# EAGLE design Rev B (EAGLE 6.4)
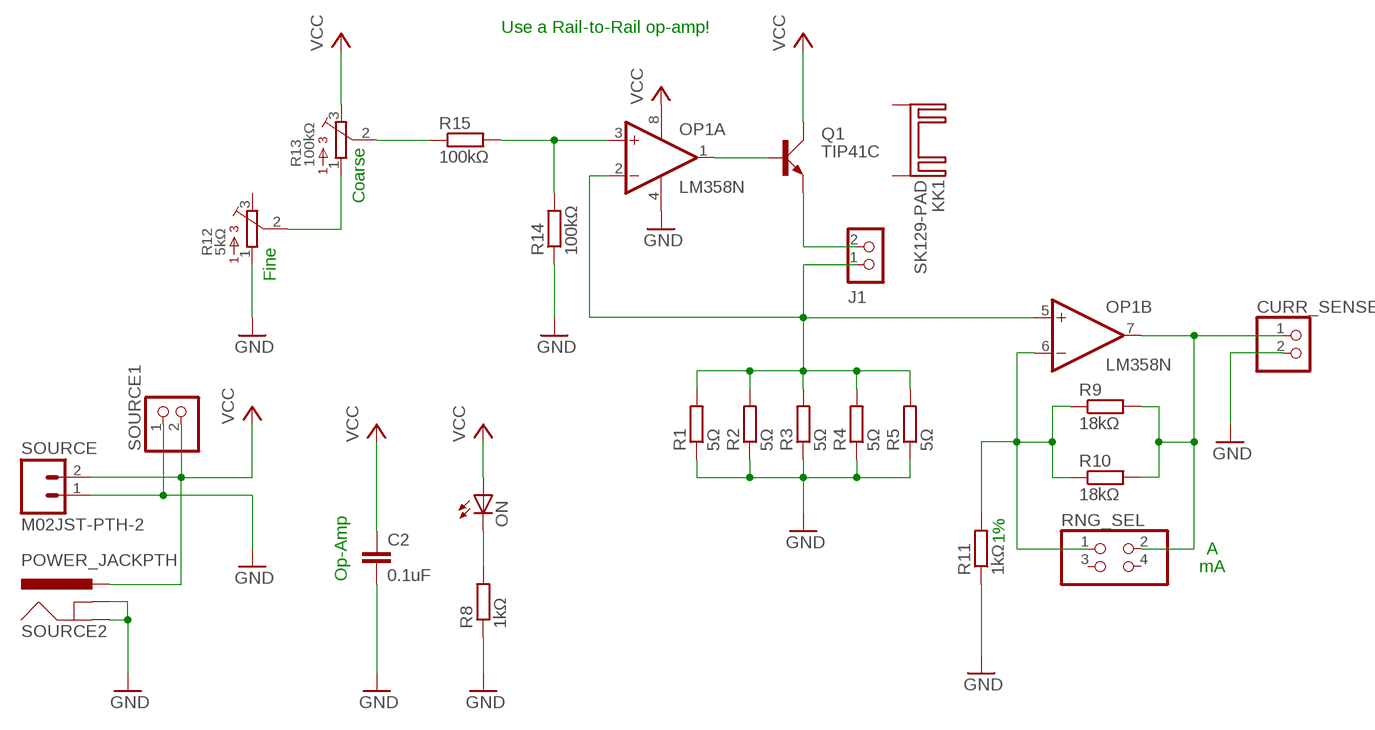
[diagram p0: schematic, sheet 1]

## Parts
C2  0.1uF  C-EU050-025X075  [C050-025X075]
CURR_SENSE  PINHD-1X2  [1X02]
J1  CON_TERMINAL_BLOCK_02-5MM  [TERMINAL_BLOCK_2P_5]
KK1  SK129-PAD  [SK129]
ON  LEDSQR2X5  [LED2X5]
OP1  LM358N  [DIL08]
Q1  TIP41C  [TO220AV]
R1  5Ω  R-EU_0613/15  [P0613/15]
R2  5Ω  R-EU_0613/15  [P0613/15]
R3  5Ω  R-EU_0613/15  [P0613/15]
R4  5Ω  R-EU_0613/15  [P0613/15]
R5  5Ω  R-EU_0613/15  [P0613/15]
R8  1kΩ  R-EU_0207/10  [0207/10]
R9  18kΩ  R-EU_0207/10  [0207/10]
R10  18kΩ  R-EU_0207/10  [0207/10]
R11  1kΩ  R-EU_0207/10  [0207/10]
R12  5kΩ  3362U  [3362U]
R13  100kΩ  3362U  [3362U]
R14  100kΩ  R-EU_0207/10  [0207/10]
R15  100kΩ  R-EU_0207/10  [0207/10]
RNG_SEL  PINHD-2X2  [2X02]
SOURCE  M02JST-PTH-2  [JST-2-PTH]
SOURCE1  PINHD-1X2  [1X02]
SOURCE2  POWER_JACKPTH  [POWER_JACK_PTH]

## Nets
CURR_SENSE: J1.1 OP1.2(A:-IN) OP1.5(B:+IN) R1.2 R2.2 R3.2 R4.2 R5.2
GND: C2.2 CURR_SENSE.2 OP1.4(P:V-) R1.1 R2.1 R3.1 R4.1 R5.1 R8.1 R11.1 R12.1 R14.1 SOURCE1.1 SOURCE2.GND SOURCE2.GNDBREAK SOURCE.1
N$1: OP1.1(A:OUT) Q1.B
N$4: J1.2 Q1.E
N$5: R12.2 R13.1
N$7: OP1.3(A:+IN) R14.2 R15.2
N$8: OP1.6(B:-IN) R9.1 R10.1 R11.2 RNG_SEL.1
N$9: CURR_SENSE.1 OP1.7(B:OUT) R9.2 R10.2 RNG_SEL.2
N$11: R13.2 R15.1
N$22: ON.K(C) R8.2
VCC: C2.1 ON.A OP1.8(P:V+) Q1.C R13.3 SOURCE1.2 SOURCE2.PWR SOURCE.2
Unconnected: KK1.A2,5(K) KK1.B2,5(K) R12.3 RNG_SEL.3 RNG_SEL.4

## Notes on the sheet
- Use a Rail-to-Rail op-amp!
- Coarse
- Fine
- 1%
- Op-Amp | A
- mA

## Library data of the parts
C2 = rcl:C-EU: CAPACITOR, European symbol
CURR_SENSE SOURCE1 = pinhead:PINHD-1X2: PIN HEADER
J1 = dp_devices:CON_TERMINAL_BLOCK_02: 2 poles wire to board terminal block
KK1 = heatsink:SK129-PAD: HEATSINK manufacturer Fischer/distributor Buerklin
ON = led:LED: LED OSRAM: - CHIPLED LG R971, LG N971, LY N971, LG Q971, LY Q971, LO R971, LY R971 LH N974, LH R974 LS Q976, LO Q976, LY Q976 LO Q996 - Hyper CHIPLED LW Q18S LB Q993, LB Q99A, LB R99A - SideLED LS A670, LO A670, LY A670, LG A670, LP A670 LB A673, LV A673, LT A673, LW A673 LH A674 LY A675 LS A676, LA A676, LO A676, LY A676, LW A676 LS A679, LY A679, LG A679 - Hyper Micro SIDELED® LS Y876, LA Y876, LO Y876, LY Y876 LT Y87S - SmartLED LW L88C, LW L88S LB L89C, LB L89S, LG L890 LS L89K, LO L89K, LY L89K LS L896, LA L896, LO L896, LY L896 - TOPLED LS T670, LO T670, LY T670, LG T670, LP T670 LSG T670, LSP T670, LSY T670, LOP T670, LYG T670 LG T671, LOG T671, LSG T671 LB T673, LV T673, LT T673, LW T673 LH T674 LS T676, LA T676, LO T676, LY T676, LB T676, LH T676, LSB T676, LW T676 LB T67C, LV T67C, LT T67C, LS T67K, LO T67K, LY T67K, LW E67C LS E67B, LA E67B, LO E67B, LY E67B, LB E67C, LV E67C, LT E67C LW T67C LS T679, LY T679, LG T679 LS T770, LO T770, LY T770, LG T770, LP T770 LB T773, LV T773, LT T773, LW T773 LH T774 LS E675, LA E675, LY E675, LS T675 LS T776, LA T776, LO T776, LY T776, LB T776 LHGB T686 LT T68C, LB T68C - Hyper Mini TOPLED® LB M676 - Mini TOPLED Santana® LG M470 LS M47K, LO M47K, LY M47K Source: http://www.osram.convergy.de LUXEON: - LUMILED® LXK2-PW12-R00, LXK2-PW12-S00, LXK2-PW14-U00, LXK2-PW14-V00 LXK2-PM12-R00, LXK2-PM12-S00, LXK2-PM14-U00 LXK2-PE12-Q00, LXK2-PE12-R00, LXK2-PE12-S00, LXK2-PE14-T00, LXK2-PE14-U00 LXK2-PB12-K00, LXK2-PB12-L00, LXK2-PB12-M00, LXK2-PB14-N00, LXK2-PB14-P00, LXK2-PB14-Q00 LXK2-PR12-L00, LXK2-PR12-M00, LXK2-PR14-Q00, LXK2-PR14-R00 LXK2-PD12-Q00, LXK2-PD12-R00, LXK2-PD12-S00 LXK2-PH12-R00, LXK2-PH12-S00 LXK2-PL12-P00, LXK2-PL12-Q00, LXK2-PL12-R00 Source: www.luxeon.com KINGBRIGHT: KA-3528ASYC Source: www.kingbright.com
OP1 = linear:LM358: OP AMP also LM158; LM258; LM2904 Source: http://cache.national.com/ds/LM/LM158.pdf
Q1 = transistor-power:TIP41C: NPN TRANSISTOR
R1-R5 R8 = rcl:R-EU_: RESISTOR, European symbol
R9-R11 R14 R15 = resistor:R-EU_: RESISTOR, European symbol
R12 R13 = bourns:3362: 3362 Series 1/4" Square Trimmer
RNG_SEL = pinhead:PINHD-2X2: PIN HEADER
SOURCE = SparkFun-Connectors:M02: Standard 2-pin 0.1" header. Use with - straight break away headers ( PRT-00116) - right angle break away headers (PRT-00553) - swiss pins (PRT-00743) - machine pins (PRT-00117) - female headers (PRT-00115) Molex polarized connector foot print use with: PRT-08233 with associated crimp pins and housings. 2.54_SCREWTERM for use with PRT-10571. 3.5mm Screw Terminal footprints for PRT-08084 5mm Screw Terminal footprints for use with PRT-08433
SOURCE2 = SparkFun-Connectors:POWER_JACK: Power Jack This is the standard 5.5mm barrel jack for power. The PTH is the most common, proven, reliable, footprint. The Slot footprint only works if the mill layer is transmitted to the PCB fab house so be warned. Spark Fun Electronics SKU : PRT-00119 SMT: CONN-08106 Mating wall wart : TOL-00298 (and others)

## Board
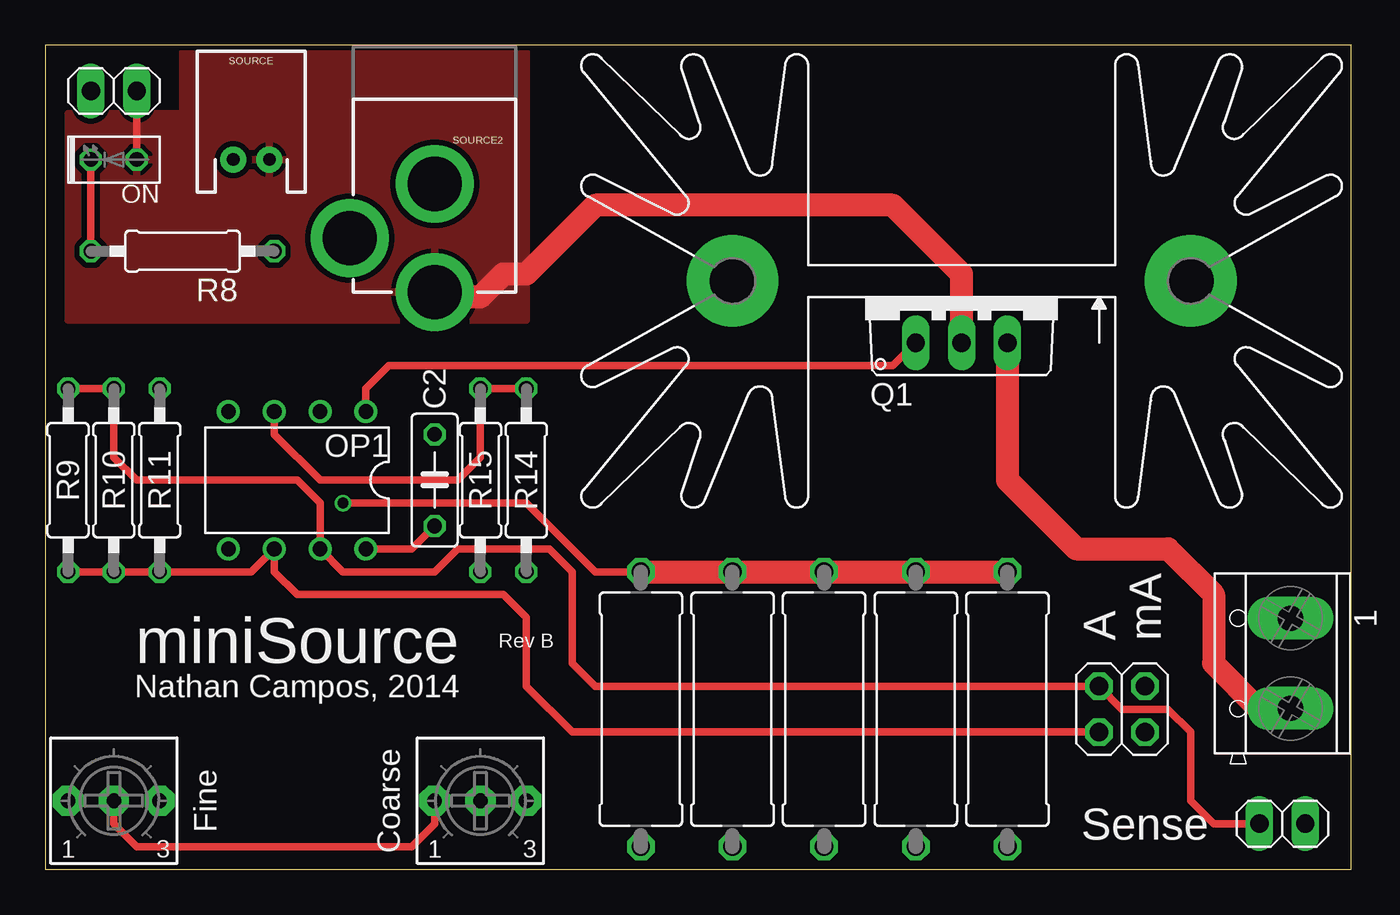
[diagram p1: board, top side]
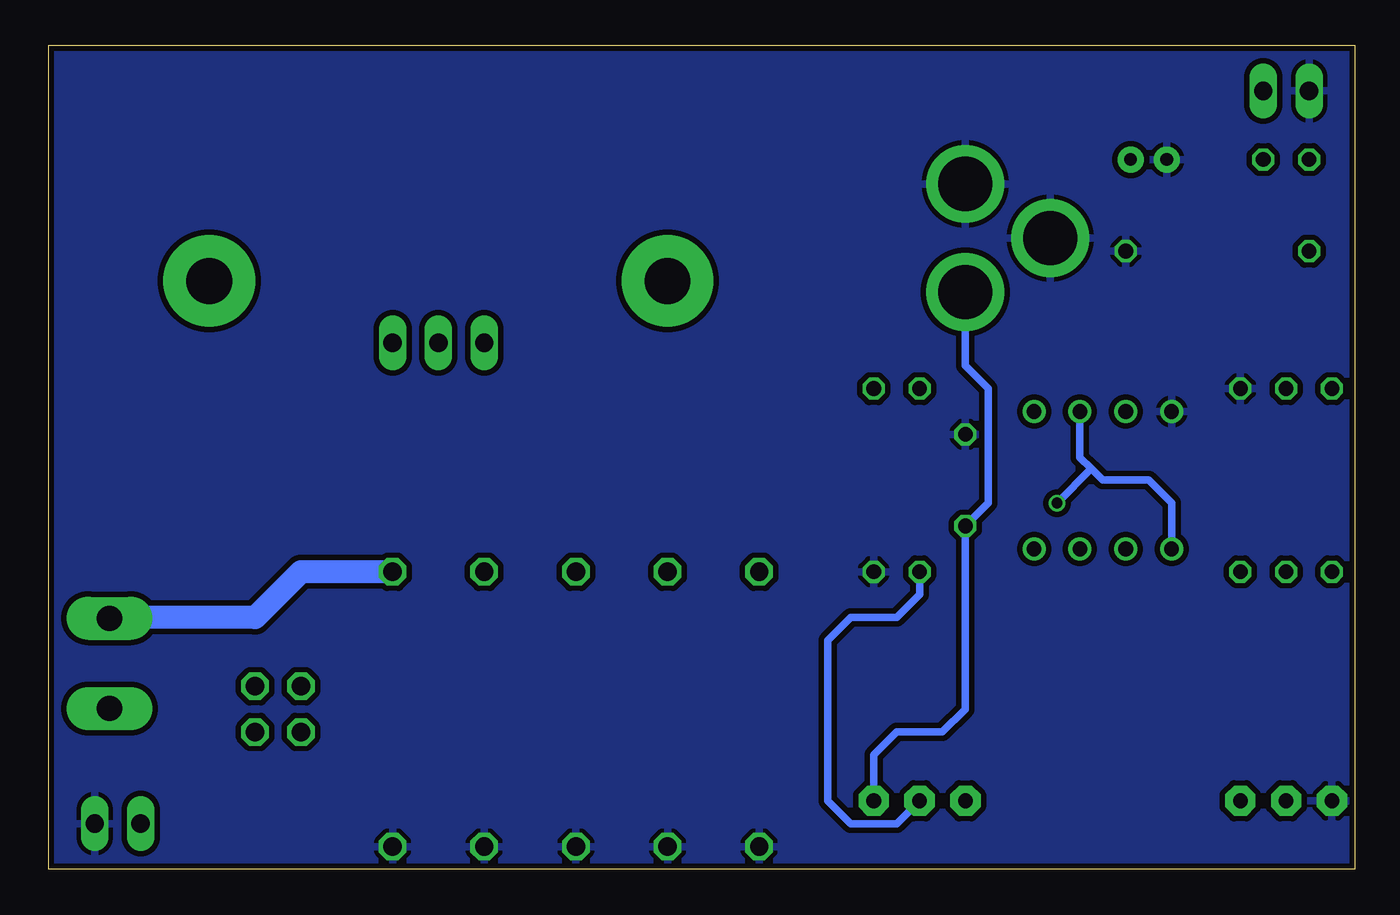
[diagram p2: board, bottom side, seen from below]

Size 72.39 x 45.72 mm. Coordinates in mm from the lower left corner, seen from the top.
Outline: 0,0 72.39,0 72.39,45.72 0,45.72 0,0
Copper layers (1*2*15*16): Top 0.035mm / dielectric 0.2mm / Route2 0.0175mm / dielectric 1.1mm / Route15 0.0175mm / dielectric 0.2mm / Bottom 0.035mm
Design rules "SeeedStudio_DRU_no_angle_20130527": minimum track width 6mil, minimum drill 12mil, track to track 6mil, track to pad 6mil, pad to pad 6mil, via to via 6mil, smd to smd 0mil, copper to edge 10mil, drill to drill 10mil, minimum pad ring 6mil, minimum via ring 6mil, stop-mask expansion 2mil, vias tented up to drill 25mil, thermal gap 10mil

### Footprints (pad centres in the part's own frame; a part is rotated, then mirrored left to right if it is on the bottom)
C050-025X075 = drill 0.813 octagon: 1 -2.54,0; 2 2.54,0
1X02 = drill 1.016 long: 1 -1.27,0; 2 1.27,0
TERMINAL_BLOCK_2P_5 = drill 1.4 pad 2.38 long: 1 2.5,-0.45; 2 -2.5,-0.45
SK129 = drill 2.54 pad 5.08: A2,5 -12.7,-0.889; B2,5 12.7,-0.889
LED2X5 = drill 0.813 octagon: A -1.27,0; K 1.27,0
DIL08 = drill 0.813 pad 1.27: 1 -3.81,-3.81; 2 -1.27,-3.81; 3 1.27,-3.81; 4 3.81,-3.81; 5 3.81,3.81; 6 1.27,3.81; 7 -1.27,3.81; 8 -3.81,3.81
TO220AV = drill 1.016 long: B -2.54,-2.54; C 0,-2.54; E 2.54,-2.54
P0613/15 = drill 1.016 octagon: 1 -7.62,0; 2 7.62,0
0207/10 = drill 0.813 octagon: 1 -5.08,0; 2 5.08,0
3362U = drill 0.813 pad 1.676 octagon: 1 -2.54,0; 2 0,0; 3 2.54,0
2X02 = drill 1.016 octagon: 1 -1.27,-1.27; 2 -1.27,1.27; 3 1.27,-1.27; 4 1.27,1.27
JST-2-PTH = drill 0.7 pad 1.448: 1 -1,0; 2 1,0
POWER_JACK_PTH = drill 2.997 pad 4.318: GND 0,7.7; GNDBREAK 4.7,10.7; PWR 0,13.7

### Placement (x,y rotation side)
C2  21.59,21.59 90 top
CURR_SENSE  68.58,2.54 0 top
J1  68.58,11.43 90 top
KK1  50.8,31.75 180 top
ON  3.81,39.37 180 top
OP1  13.97,21.59 180 top
Q1  50.8,31.75 0 top
R1  33.02,8.89 90 top
R2  38.1,8.89 90 top
R3  43.18,8.89 90 top
R4  48.26,8.89 90 top
R5  53.34,8.89 90 top
R8  7.62,34.29 180 top
R9  1.27,21.59 90 top
R10  3.81,21.59 90 top
R11  6.35,21.59 270 top
R12  3.81,3.81 0 top
R13  24.13,3.81 0 top
R14  26.67,21.59 90 top
R15  24.13,21.59 90 top
RNG_SEL  59.69,8.89 0 top
SOURCE  11.43,39.37 0 top
SOURCE1  3.81,43.18 0 top
SOURCE2  21.59,45.72 180 top

### Tracks (layer width: path | path; a pad name or v marks a point on that pad's centre or on a via)
CURR_SENSE  (via drill 0.6)
  Top 0.406: R1.2 30.48,16.51 26.67,20.32 v16.51,20.32
  Top 1.27: R1.2 R2.2 R3.2 R4.2 R5.2
  Bottom 0.406: OP1.5 10.16,20.32 11.43,21.59 13.97,21.59 14.61,22.23 | 14.61,22.23 15.24,22.86 OP1.2 | v16.51,20.32 14.61,22.23
  Bottom 1.27: R5.2 58.42,16.51 60.96,13.97 68.99,13.97 J1.1
GND
  pour Bottom (isolate 0.305): 0,45.72 0,0 72.39,0 72.39,45.72
N$1
  Top 0.406: OP1.1 17.78,26.67 19.05,27.94 46.99,27.94 Q1.B
N$4
  Top 1.27: Q1.E 53.34,21.59 57.15,17.78 62.23,17.78 64.77,15.24 64.77,11.43 67.31,8.89 68.99,8.89 J1.2
N$5
  Top 0.406: R12.2 3.81,2.54 5.08,1.27 20.32,1.27 21.59,2.54 R13.1
N$7
  Top 0.406: OP1.3 12.7,24.13 15.24,21.59 22.86,21.59 24.13,22.86 R15.2 R14.2
N$8
  Top 0.406: R9.1 R10.1 R11.2 11.43,16.51 OP1.6 12.7,16.51 13.97,15.24 25.4,15.24 26.67,13.97 26.67,10.16 29.21,7.62 RNG_SEL.1
N$9
  Top 0.406: R9.2 R10.2 3.81,22.86 5.08,21.59 13.97,21.59 15.24,20.32 OP1.7 16.51,16.51 21.59,16.51 22.86,17.78 27.94,17.78 29.21,16.51 29.21,11.43 30.48,10.16 RNG_SEL.2 59.69,8.89 62.23,8.89 63.5,7.62 63.5,3.81 64.77,2.54 CURR_SENSE.1
N$11
  Bottom 0.406: R13.2 25.4,2.54 27.94,2.54 29.21,3.81 29.21,12.7 27.94,13.97 25.4,13.97 24.13,15.24 R15.1
N$22
  Top 0.406: ON.K R8.2
VCC
  Top 0.406: SOURCE1.2 ON.A | C2.1 20.32,17.78 OP1.8
  Top 1.27: Q1.C 50.8,33.02 46.99,36.83 30.48,36.83 26.67,33.02 25.4,33.02 24.13,31.75 21.86,31.75 SOURCE2.PWR
  Bottom 0.406: SOURCE2.PWR 21.59,27.94 20.32,26.67 20.32,20.32 C2.1 21.59,8.89 22.86,7.62 25.4,7.62 26.67,6.35 R13.3
  pour Top (isolate 0.305): 7.62,45.72 26.67,45.72 26.67,30.48 1.27,30.48 1.27,41.91 7.62,41.91

### Text on the board
tPlace: miniSource | Rev B | A | mA | Nathan Campos, 2014 | Fine | Coarse | Sense